# Altium schematic sheet OMODRI_GPIO.SchDoc
size A3; Date: Not shown in title block; ApprovedBy: Not shown in title block; CheckedBy: Not shown in title block; Author: Not shown in title block; CompanyName: Not shown in title block; DrawnBy: Cody Watkins; Engineer: Not shown in title block; Organization: Not shown in title block; Address1: Not shown in title block; Address2: Not shown in title block; Address3: Not shown in title block; Address4: Not shown in title block; DocumentNumber: 2; Revision: Use project parameter SCH_Rev; SheetNumber: 2; SheetTotal: 11; PageSetup: Record=PageOptions|CenterHorizontal=True|CenterVertical=True|PrintScale=1.00|XCorrection=1.00|YCorrection=1.00|PrintKind=0|BorderSize=5000000|LeftOffset=0|BottomOffset=0|Orientation=2|PaperLength=1000|PaperWidth=1000|Scale=100|PaperSource=15|PrintQuality=600|MediaType=1|DitherType=10|PaperKind=Letter|PrintScaleMode=1; CurrentTime: Not shown in title block; CurrentDate: Not shown in title block; Time: Not shown in title block; DocumentFullPathAndName: Not shown in title block; DocumentName: Not shown in title block; ModifiedDate: Not shown in title block; ImagePath: Not shown in title block
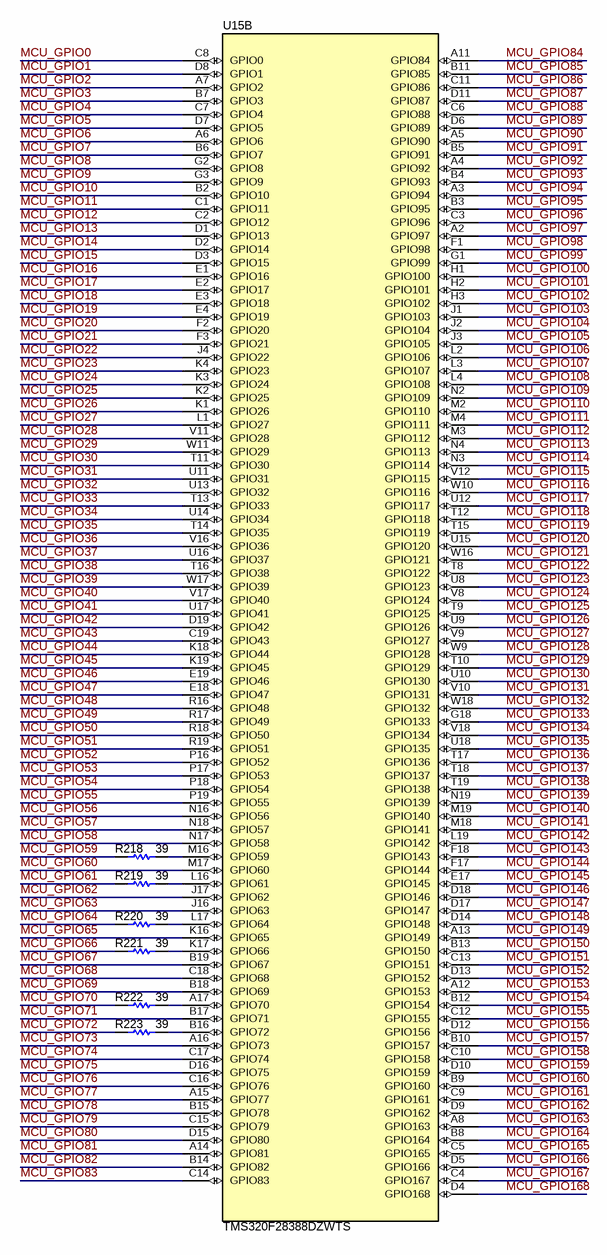
[diagram p0: OMODRI_GPIO.SchDoc]

## Parts
R218  ValueDisplayed: 39  [0402]  (hidden comment: CRCW040239R0JNED)
R219  ValueDisplayed: 39  [0402]  (hidden comment: CRCW040239R0JNED)
R220  ValueDisplayed: 39  [0402]  (hidden comment: CRCW040239R0JNED)
R221  ValueDisplayed: 39  [0402]  (hidden comment: CRCW040239R0JNED)
R222  ValueDisplayed: 39  [0402]  (hidden comment: CRCW040239R0JNED)
R223  ValueDisplayed: 39  [0402]  (hidden comment: CRCW040239R0JNED)
U15  TMS320F28388DZWTS  [ZWT0337A]  (part B of 5)

## Nets
MCU_GPIO0: U15.C8(GPIO0)
MCU_GPIO1: U15.D8(GPIO1)
MCU_GPIO2: U15.A7(GPIO2)
MCU_GPIO3: U15.B7(GPIO3)
MCU_GPIO4: U15.C7(GPIO4)
MCU_GPIO5: U15.D7(GPIO5)
MCU_GPIO6: U15.A6(GPIO6)
MCU_GPIO7: U15.B6(GPIO7)
MCU_GPIO8: U15.G2(GPIO8)
MCU_GPIO9: U15.G3(GPIO9)
MCU_GPIO10: U15.B2(GPIO10)
MCU_GPIO11: U15.C1(GPIO11)
MCU_GPIO12: U15.C2(GPIO12)
MCU_GPIO13: U15.D1(GPIO13)
MCU_GPIO14: U15.D2(GPIO14)
MCU_GPIO15: U15.D3(GPIO15)
MCU_GPIO16: U15.E1(GPIO16)
MCU_GPIO17: U15.E2(GPIO17)
MCU_GPIO18: U15.E3(GPIO18)
MCU_GPIO19: U15.E4(GPIO19)
MCU_GPIO20: U15.F2(GPIO20)
MCU_GPIO21: U15.F3(GPIO21)
MCU_GPIO22: U15.J4(GPIO22)
MCU_GPIO23: U15.K4(GPIO23)
MCU_GPIO24: U15.K3(GPIO24)
MCU_GPIO25: U15.K2(GPIO25)
MCU_GPIO26: U15.K1(GPIO26)
MCU_GPIO27: U15.L1(GPIO27)
MCU_GPIO28: U15.V11(GPIO28)
MCU_GPIO29: U15.W11(GPIO29)
MCU_GPIO30: U15.T11(GPIO30)
MCU_GPIO31: U15.U11(GPIO31)
MCU_GPIO32: U15.U13(GPIO32)
MCU_GPIO33: U15.T13(GPIO33)
MCU_GPIO34: U15.U14(GPIO34)
MCU_GPIO35: U15.T14(GPIO35)
MCU_GPIO36: U15.V16(GPIO36)
MCU_GPIO37: U15.U16(GPIO37)
MCU_GPIO38: U15.T16(GPIO38)
MCU_GPIO39: U15.W17(GPIO39)
MCU_GPIO40: U15.V17(GPIO40)
MCU_GPIO41: U15.U17(GPIO41)
MCU_GPIO42: U15.D19(GPIO42)
MCU_GPIO43: U15.C19(GPIO43)
MCU_GPIO44: U15.K18(GPIO44)
MCU_GPIO45: U15.K19(GPIO45)
MCU_GPIO46: U15.E19(GPIO46)
MCU_GPIO47: U15.E18(GPIO47)
MCU_GPIO48: U15.R16(GPIO48)
MCU_GPIO49: U15.R17(GPIO49)
MCU_GPIO50: U15.R18(GPIO50)
MCU_GPIO51: U15.R19(GPIO51)
MCU_GPIO52: U15.P16(GPIO52)
MCU_GPIO53: U15.P17(GPIO53)
MCU_GPIO54: U15.P18(GPIO54)
MCU_GPIO55: U15.P19(GPIO55)
MCU_GPIO56: U15.N16(GPIO56)
MCU_GPIO57: U15.N18(GPIO57)
MCU_GPIO58: U15.N17(GPIO58)
MCU_GPIO59: R218.1
MCU_GPIO60: U15.M17(GPIO60)
MCU_GPIO61: R219.1
MCU_GPIO62: U15.J17(GPIO62)
MCU_GPIO63: U15.J16(GPIO63)
MCU_GPIO64: R220.1
MCU_GPIO65: U15.K16(GPIO65)
MCU_GPIO66: R221.1
MCU_GPIO67: U15.B19(GPIO67)
MCU_GPIO68: U15.C18(GPIO68)
MCU_GPIO69: U15.B18(GPIO69)
MCU_GPIO70: R222.1
MCU_GPIO71: U15.B17(GPIO71)
MCU_GPIO72: R223.1
MCU_GPIO73: U15.A16(GPIO73)
MCU_GPIO74: U15.C17(GPIO74)
MCU_GPIO75: U15.D16(GPIO75)
MCU_GPIO76: U15.C16(GPIO76)
MCU_GPIO77: U15.A15(GPIO77)
MCU_GPIO78: U15.B15(GPIO78)
MCU_GPIO79: U15.C15(GPIO79)
MCU_GPIO80: U15.D15(GPIO80)
MCU_GPIO81: U15.A14(GPIO81)
MCU_GPIO82: U15.B14(GPIO82)
MCU_GPIO83: U15.C14(GPIO83)
MCU_GPIO84: U15.A11(GPIO84)
MCU_GPIO85: U15.B11(GPIO85)
MCU_GPIO86: U15.C11(GPIO86)
MCU_GPIO87: U15.D11(GPIO87)
MCU_GPIO88: U15.C6(GPIO88)
MCU_GPIO89: U15.D6(GPIO89)
MCU_GPIO90: U15.A5(GPIO90)
MCU_GPIO91: U15.B5(GPIO91)
MCU_GPIO92: U15.A4(GPIO92)
MCU_GPIO93: U15.B4(GPIO93)
MCU_GPIO94: U15.A3(GPIO94)
MCU_GPIO95: U15.B3(GPIO95)
MCU_GPIO96: U15.C3(GPIO96)
MCU_GPIO97: U15.A2(GPIO97)
MCU_GPIO98: U15.F1(GPIO98)
MCU_GPIO99: U15.G1(GPIO99)
MCU_GPIO100: U15.H1(GPIO100)
MCU_GPIO101: U15.H2(GPIO101)
MCU_GPIO102: U15.H3(GPIO102)
MCU_GPIO103: U15.J1(GPIO103)
MCU_GPIO104: U15.J2(GPIO104)
MCU_GPIO105: U15.J3(GPIO105)
MCU_GPIO106: U15.L2(GPIO106)
MCU_GPIO107: U15.L3(GPIO107)
MCU_GPIO108: U15.L4(GPIO108)
MCU_GPIO109: U15.N2(GPIO109)
MCU_GPIO110: U15.M2(GPIO110)
MCU_GPIO111: U15.M4(GPIO111)
MCU_GPIO112: U15.M3(GPIO112)
MCU_GPIO113: U15.N4(GPIO113)
MCU_GPIO114: U15.N3(GPIO114)
MCU_GPIO115: U15.V12(GPIO115)
MCU_GPIO116: U15.W10(GPIO116)
MCU_GPIO117: U15.U12(GPIO117)
MCU_GPIO118: U15.T12(GPIO118)
MCU_GPIO119: U15.T15(GPIO119)
MCU_GPIO120: U15.U15(GPIO120)
MCU_GPIO121: U15.W16(GPIO121)
MCU_GPIO122: U15.T8(GPIO122)
MCU_GPIO123: U15.U8(GPIO123)
MCU_GPIO124: U15.V8(GPIO124)
MCU_GPIO125: U15.T9(GPIO125)
MCU_GPIO126: U15.U9(GPIO126)
MCU_GPIO127: U15.V9(GPIO127)
MCU_GPIO128: U15.W9(GPIO128)
MCU_GPIO129: U15.T10(GPIO129)
MCU_GPIO130: U15.U10(GPIO130)
MCU_GPIO131: U15.V10(GPIO131)
MCU_GPIO132: U15.W18(GPIO132)
MCU_GPIO133: U15.G18(GPIO133)
MCU_GPIO134: U15.V18(GPIO134)
MCU_GPIO135: U15.U18(GPIO135)
MCU_GPIO136: U15.T17(GPIO136)
MCU_GPIO137: U15.T18(GPIO137)
MCU_GPIO138: U15.T19(GPIO138)
MCU_GPIO139: U15.N19(GPIO139)
MCU_GPIO140: U15.M19(GPIO140)
MCU_GPIO141: U15.M18(GPIO141)
MCU_GPIO142: U15.L19(GPIO142)
MCU_GPIO143: U15.F18(GPIO143)
MCU_GPIO144: U15.F17(GPIO144)
MCU_GPIO145: U15.E17(GPIO145)
MCU_GPIO146: U15.D18(GPIO146)
MCU_GPIO147: U15.D17(GPIO147)
MCU_GPIO148: U15.D14(GPIO148)
MCU_GPIO149: U15.A13(GPIO149)
MCU_GPIO150: U15.B13(GPIO150)
MCU_GPIO151: U15.C13(GPIO151)
MCU_GPIO152: U15.D13(GPIO152)
MCU_GPIO153: U15.A12(GPIO153)
MCU_GPIO154: U15.B12(GPIO154)
MCU_GPIO155: U15.C12(GPIO155)
MCU_GPIO156: U15.D12(GPIO156)
MCU_GPIO157: U15.B10(GPIO157)
MCU_GPIO158: U15.C10(GPIO158)
MCU_GPIO159: U15.D10(GPIO159)
MCU_GPIO160: U15.B9(GPIO160)
MCU_GPIO161: U15.C9(GPIO161)
MCU_GPIO162: U15.D9(GPIO162)
MCU_GPIO163: U15.A8(GPIO163)
MCU_GPIO164: U15.B8(GPIO164)
MCU_GPIO165: U15.C5(GPIO165)
MCU_GPIO166: U15.D5(GPIO166)
MCU_GPIO167: U15.C4(GPIO167)
MCU_GPIO168: U15.D4(GPIO168)
NetR218_2: R218.2 U15.M16(GPIO59)
NetR219_2: R219.2 U15.L16(GPIO61)
NetR220_2: R220.2 U15.L17(GPIO64)
NetR221_2: R221.2 U15.K17(GPIO66)
NetR222_2: R222.2 U15.A17(GPIO70)
NetR223_2: R223.2 U15.B16(GPIO72)

## Notes on the sheet
- Drawn By:
- SVN Rev:
- Number:
- TID #:
- Orderable:
- Rev:
- Sheet Title:
- File:
- Project Title:
- Designed for:
- Assembly Variant:
- Mod. Date:
- Sheet:
- Size:
- of
- B
- http://www.ti.com
- Texas Instruments and/or its licensors do not warrant the accuracy or completeness of this specification or any information contained therein. Texas Instruments and/or its licensors do not warrant that this design will meet the specifications, will be suitable for your application or fit for any particular purpose, or will operate in an implementation. Texas Instruments and/or its licensors do not warrant that the design is production worthy. You should completely validate and test your design implementation to confirm the system functionality for your application.
- Engineer:
- Contact:
- © Texas Instruments

## Library data of the parts
R218-R223 = CMP-0026916-3: RES, 39, 5%, 0.063 W, AEC-Q200 Grade 0, 0402; Manufacturer: Vishay-Dale; Power_W: 63mW; TempCo: 200 ppm/C; Value_Code: 39R0; Value: 39; EIA_Code: E24; SizeX_mm: 1; SizeY_mm: 0.5; SizeZ_mm: 0.6; Value2: 0.063W; AEC Qualified: Y; VDC_V: 50V; AEC Category: Q200; AEC Grade: 0; Supplier Part Number 2: 89M6649; Supplier 2: Newark; Supplier Part Number 3: 71-CRCW0402J-39-E3; Supplier 3: Mouser; RoHS: E; Value1: 5%; MountType: SMT; Supplier 1: Digi-Key; PackageReference: 0402; Tolerance_%: 5%; Res_ohm: 39; SizeArea_mm2: 0.5; CompType: Resistor; PartNumber: CRCW040239R0JNED; ComponentLink1Description: Datasheet link; Supplier Part Number 1: 541-39JCT-ND; Technology: Thick Film; ComponentLink1URL: http://www.vishay.com/docs/20035/dcrcwe3.pdf
U15 = CMP-0081777-3: TMS320F28388DZWTS, ZWT0337A (NFBGA-337); Manufacturer: Texas Instruments; SizeAreaWB_mm2: 324; SizeArea_mm2: 256; AEC Qualified: N; AEC Category: Q200; SizeZ_mm: 1.4; SizeY_mm: 16; CompType: IC; ComponentLink1Description: Datasheet Link; ComponentLink2Description: Product Folder; PackageReference: ZWT0337A; PartNumber: TMS320F28388DZWTS; PackageDescription: NFBGA-337; ComponentLink2URL: http://www.ti.com/product/tms320f28388d; Alternate Manufacturer: Texas Instruments; ComponentLink3URL: http://www.ti.com/product/tms320f28388d/datasheet; ComponentLink1URL: http://www.ti.com/lit/ds/symlink/tms320f28388d.pdf; MountType: SMT; ComponentLink3Description: Online Datasheet; SizeX_mm: 16